# EAGLE design Delay_Circuit (EAGLE 7.2.0)
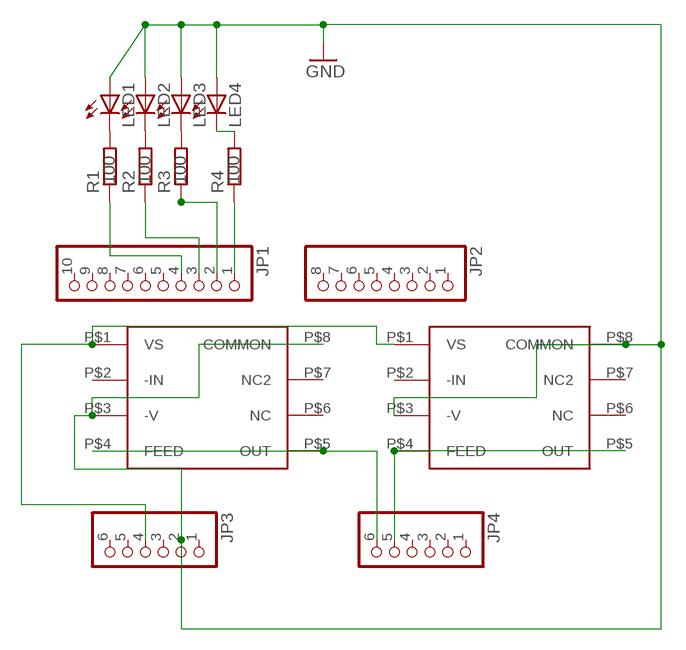
[diagram p0: schematic, sheet 1]

## Parts
JP1  PINHD-1X10  [1X10]
JP2  PINHD-1X8  [1X08]
JP3  PINHD-1X6  [1X06]
JP4  PINHD-1X6  [1X06]
LED1  LED5MM  [LED5MM]
LED2  LED5MM  [LED5MM]
LED3  LED5MM  [LED5MM]
LED4  LED5MM  [LED5MM]
OPT101_1  OPT101P  [OPT101P]
OPT101_2  OPT101P  [OPT101P]
R1  100  R0204/7  [0204/7]
R2  100  R0204/7  [0204/7]
R3  100  R0204/7  [0204/7]
R4  100  R0204/7  [0204/7]

## Nets
GND: JP3.2 LED1.A LED2.A LED3.A LED4.A OPT101_1.P$3(-V) OPT101_1.P$8(COMMON) OPT101_2.P$3(-V) OPT101_2.P$8(COMMON)
N$1: LED2.K(C) R2.2
N$2: LED1.K(C) R1.2
N$3: LED3.K(C) R3.2
N$4: LED4.K(C) R4.2
N$5: JP1.1 R4.1
N$6: JP1.2 R3.1
N$7: JP1.3 R2.1
N$8: JP1.4 R1.1
N$9: JP3.4 OPT101_1.P$1(VS) OPT101_2.P$1(VS)
N$10: JP4.6 OPT101_1.P$4(FEED) OPT101_1.P$5(OUT)
N$11: JP4.5 OPT101_2.P$4(FEED) OPT101_2.P$5(OUT)
Unconnected: JP1.5 JP1.6 JP1.7 JP1.8 JP1.9 JP1.10 JP2.1 JP2.2 JP2.3 JP2.4 JP2.5 JP2.6 JP2.7 JP2.8 JP3.1 JP3.3 JP3.5 JP3.6 JP4.1 JP4.2 JP4.3 JP4.4 OPT101_1.P$2(-IN) OPT101_1.P$6(NC) OPT101_1.P$7(NC2) OPT101_2.P$2(-IN) OPT101_2.P$6(NC) OPT101_2.P$7(NC2)

## Library data of the parts
JP1 = pinhead:PINHD-1X10: PIN HEADER
JP2 = pinhead:PINHD-1X8: PIN HEADER
JP3 JP4 = pinhead:PINHD-1X6: PIN HEADER
LED1-LED4 = adafruit:LED: LED OSRAM: - CHIPLED LG R971, LG N971, LY N971, LG Q971, LY Q971, LO R971, LY R971 LH N974, LH R974 LS Q976, LO Q976, LY Q976 LO Q996 - Hyper CHIPLED LW Q18S LB Q993, LB Q99A, LB R99A - SideLED LS A670, LO A670, LY A670, LG A670, LP A670 LB A673, LV A673, LT A673, LW A673 LH A674 LY A675 LS A676, LA A676, LO A676, LY A676, LW A676 LS A679, LY A679, LG A679 - Hyper Micro SIDELED® LS Y876, LA Y876, LO Y876, LY Y876 LT Y87S - SmartLED LW L88C, LW L88S LB L89C, LB L89S, LG L890 LS L89K, LO L89K, LY L89K LS L896, LA L896, LO L896, LY L896 - TOPLED LS T670, LO T670, LY T670, LG T670, LP T670 LSG T670, LSP T670, LSY T670, LOP T670, LYG T670 LG T671, LOG T671, LSG T671 LB T673, LV T673, LT T673, LW T673 LH T674 LS T676, LA T676, LO T676, LY T676, LB T676, LH T676, LSB T676, LW T676 LB T67C, LV T67C, LT T67C, LS T67K, LO T67K, LY T67K, LW E67C LS E67B, LA E67B, LO E67B, LY E67B, LB E67C, LV E67C, LT E67C LW T67C LS T679, LY T679, LG T679 LS T770, LO T770, LY T770, LG T770, LP T770 LB T773, LV T773, LT T773, LW T773 LH T774 LS E675, LA E675, LY E675, LS T675 LS T776, LA T776, LO T776, LY T776, LB T776 LHGB T686 LT T68C, LB T68C - Hyper Mini TOPLED® LB M676 - Mini TOPLED Santana® LG M470 LS M47K, LO M47K, LY M47K Source: http://www.osram.convergy.de/
OPT101_1 OPT101_2 = opt101p:OPT101P
R1-R4 = eagle-ltspice:R: RESISTOR, European symbol; SPICEMODEL: NONE; SPICEPREFIX: R

## Board
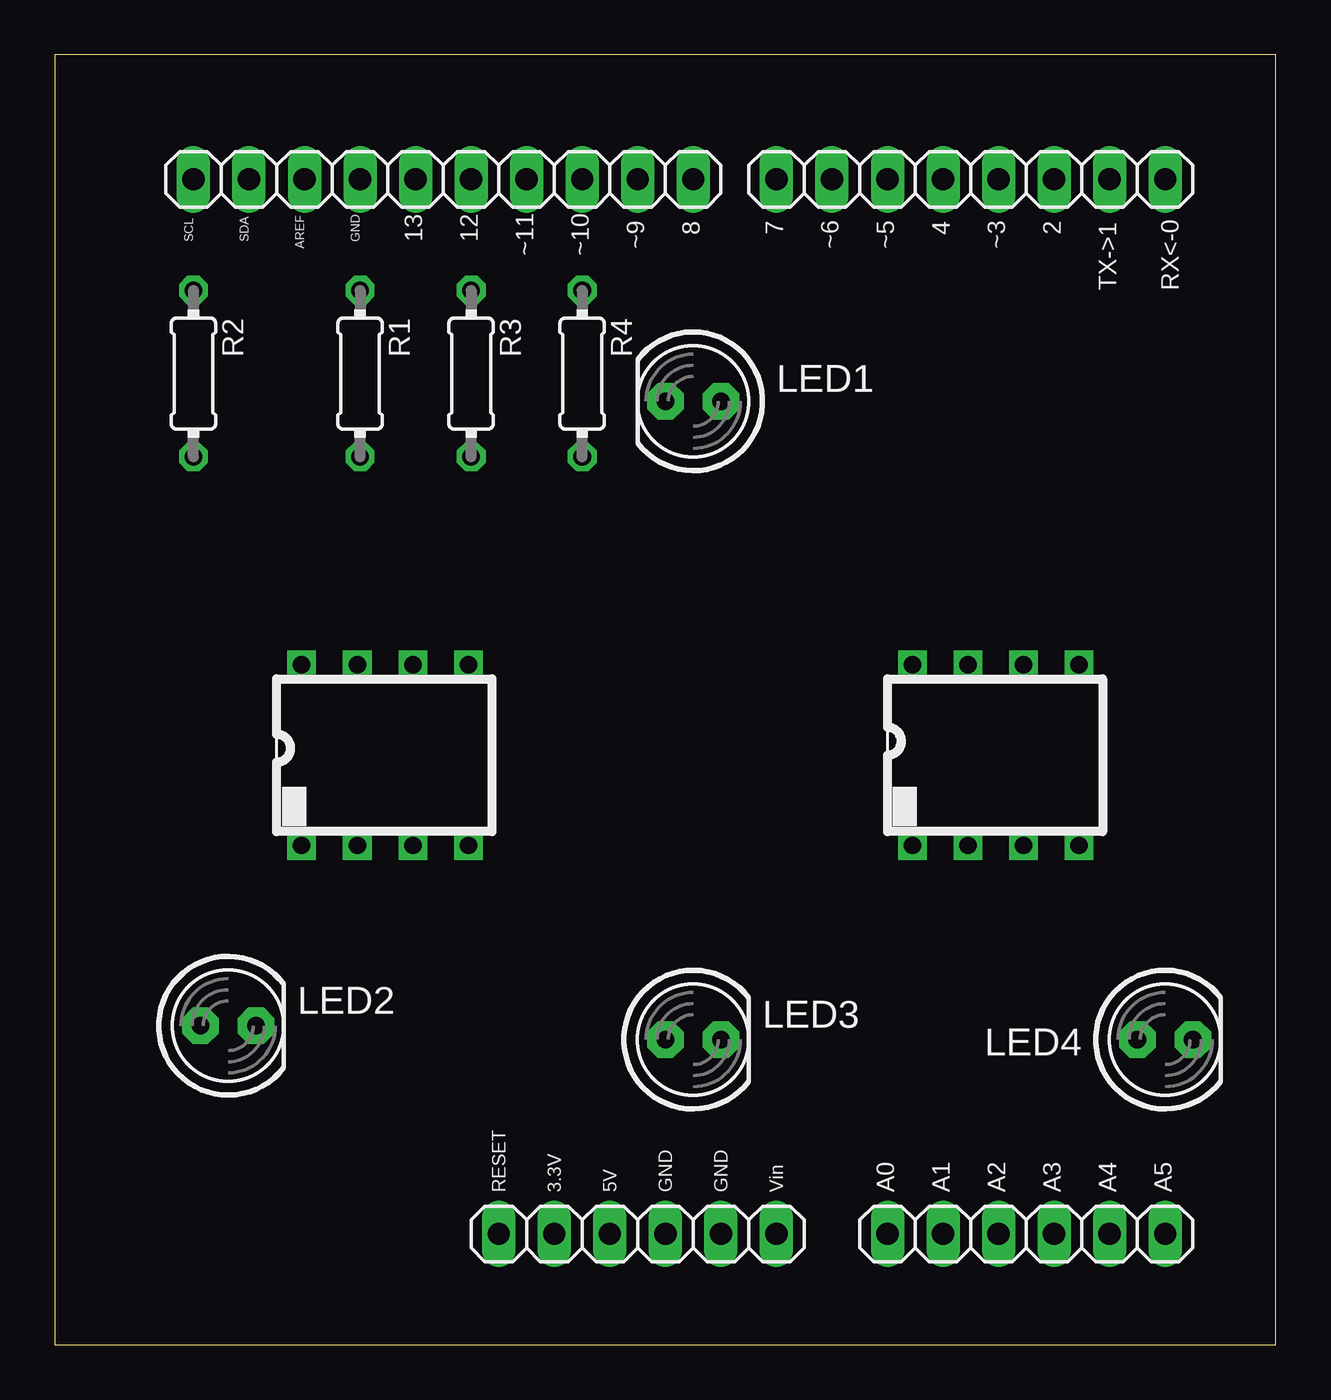
[diagram p1: board, top side]
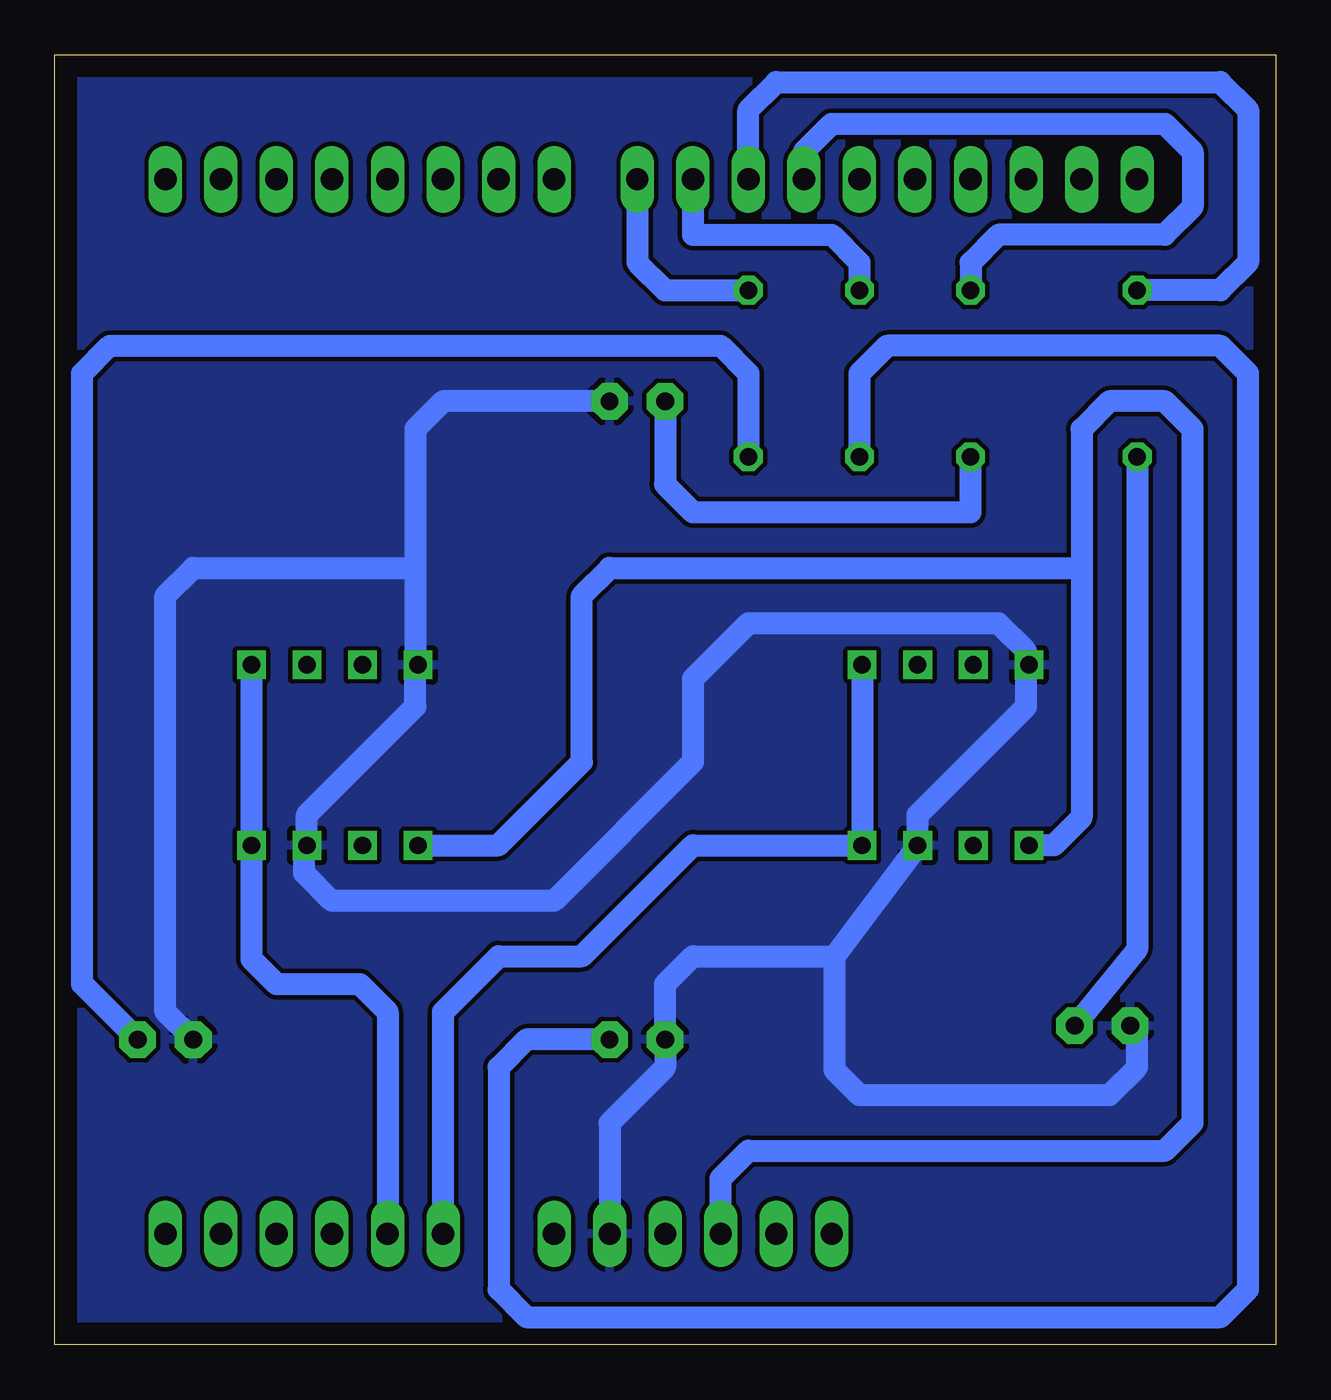
[diagram p2: board, bottom side, seen from below]

Size 55.87 x 59.05 mm. Coordinates in mm from the lower left corner, seen from the top.
Outline: 0,0 55.87,0 55.87,59.05 0,59.05 0,0
Copper layers (1*16): Top 0.035mm / dielectric 1.5mm / Bottom 0.035mm
Design rules "default": minimum track width 10mil, minimum drill 24mil, track to track 8mil, track to pad 8mil, pad to pad 8mil, via to via 8mil, smd to smd 8mil, copper to edge 40mil, drill to drill 8mil, minimum pad ring 10mil, minimum via ring 8mil, stop-mask expansion 4mil, vias tented up to drill 0mil, thermal gap 10mil

### Footprints (pad centres in the part's own frame; a part is rotated, then mirrored left to right if it is on the bottom)
1X10 = drill 1.016 long: 1 -11.43,0; 2 -8.89,0; 3 -6.35,0; 4 -3.81,0; 5 -1.27,0; 6 1.27,0; 7 3.81,0; 8 6.35,0; 9 8.89,0; 10 11.43,0
1X08 = drill 1.016 long: 1 -8.89,0; 2 -6.35,0; 3 -3.81,0; 4 -1.27,0; 5 1.27,0; 6 3.81,0; 7 6.35,0; 8 8.89,0
1X06 = drill 1.016 long: 1 -6.35,0; 2 -3.81,0; 3 -1.27,0; 4 1.27,0; 5 3.81,0; 6 6.35,0
LED5MM = drill 0.813 pad 1.676 octagon: A -1.27,0; K 1.27,0
OPT101P = drill 0.8 square: P$1 7.625,1.14; P$2 7.625,3.685; P$3 7.625,6.225; P$4 7.625,8.765; P$5 -0.635,8.765; P$6 -0.635,6.225; P$7 -0.635,3.685; P$8 -0.635,1.14
0204/7 = drill 0.813 octagon: 1 -3.81,0; 2 3.81,0

### Placement (x,y rotation side)
JP1  17.78,53.34 180 top
JP2  41.91,53.34 180 top
JP3  26.67,5.08 180 top
JP4  44.45,5.08 180 top
LED1  29.21,43.18 180 top
LED2  7.94,14.61 0 top
LED3  29.21,13.97 0 top
LED4  50.8,13.97 0 top
OPT101_1  10.16,30.48 270 top
OPT101_2  38.1,30.48 270 top
R1  13.97,44.45 270 top
R2  6.35,44.45 270 top
R3  19.05,44.45 270 top
R4  24.13,44.45 270 top

### Tracks (layer width: path | path; a pad name or v marks a point on that pad's centre or on a via)
GND
  Bottom 1.016: 11.43,30.98 11.43,29.21 16.39,24.25 OPT101_1.P$3 20.2,17.78 | 11.43,30.98 OPT101_1.P$8 | 20.2,17.78 20.2,12.57 19.05,11.43 7.62,11.43 6.35,12.7 6.35,14.29 LED2.A | 20.2,17.78 26.67,17.78 27.94,16.51 LED3.A 27.94,12.7 30.48,10.16 JP3.2 | 11.43,30.98 11.43,31.75 12.7,33.02 24.13,33.02 26.67,30.48 26.67,26.67 33.02,20.32 43.18,20.32 44.45,21.59 44.45,22.73 OPT101_2.P$3 44.33,24.25 39.37,29.21 39.37,30.98 | 39.37,30.98 OPT101_2.P$8 | LED1.A 38.1,43.18 39.37,41.91 39.37,35.56 | 39.37,35.56 39.37,30.98 | LED4.A 50.8,15.24 50.8,34.29 49.53,35.56 39.37,35.56
  pour Bottom: 0.32,0 0.32,59.05 55.88,59.05 55.88,0.32 55.88,0
N$1
  Bottom 1.016: R2.2 6.35,18.1 LED2.K
N$2
  Bottom 1.016: LED1.K 27.94,39.37 26.67,38.1 13.97,38.1 R1.2
N$3
  Bottom 1.016: LED3.K 34.29,13.97 35.56,12.7 35.56,2.54 34.29,1.27 2.54,1.27 1.27,2.54 1.27,44.45 2.54,45.72 17.78,45.72 19.05,44.45 R3.2
N$4
  Bottom 1.016: LED4.K 54.61,16.51 54.61,44.45 53.34,45.72 25.4,45.72 24.13,44.45 R4.2
N$5
  Bottom 1.016: JP1.1 29.21,49.53 27.94,48.26 R4.1
N$6
  Bottom 1.016: JP1.2 26.67,50.8 20.32,50.8 19.05,49.53 R3.1
N$7
  Bottom 1.016: JP1.3 24.13,56.52 22.86,57.78 2.54,57.78 1.27,56.52 1.27,49.53 2.54,48.26 R2.1
N$8
  Bottom 1.016: JP1.4 21.59,54.61 20.32,55.88 5.08,55.88 3.81,54.61 3.81,52.07 5.08,50.8 12.7,50.8 13.97,49.53 R1.1
N$9
  Bottom 1.016: JP3.4 25.4,7.62 24.13,8.89 5.08,8.89 3.81,10.16 3.81,41.91 5.08,43.18 7.62,43.18 8.89,41.91 8.89,35.56 | 8.89,35.56 8.89,24.13 10.16,22.86 OPT101_1.P$1 | OPT101_2.P$1 35.56,22.86 31.75,26.67 31.75,34.29 30.48,35.56 8.89,35.56
N$10
  Bottom 1.016: OPT101_1.P$5 OPT101_1.P$4 26.67,22.86 31.75,17.78 35.56,17.78 38.1,15.24 JP4.6
N$11
  Bottom 1.016: OPT101_2.P$5 OPT101_2.P$4 46.87,17.66 45.72,16.51 41.91,16.51 40.64,15.24 JP4.5

### Text on the board
Bottom: 8
tNames: 8 | 7 | 4 | 2 | SCL | SDA | AREF | GND | 13 | 12 | ~11 | ~10 | ~9 | ~6 | ~5 | ~3 | TX->1 | RX<-0 | RESET | 3.3V | 5V | GND | GND | Vin | A0 | A1 | A2 | A3 | A4 | A5